# Altium schematic sheet Sheet1.SchDoc
size A3
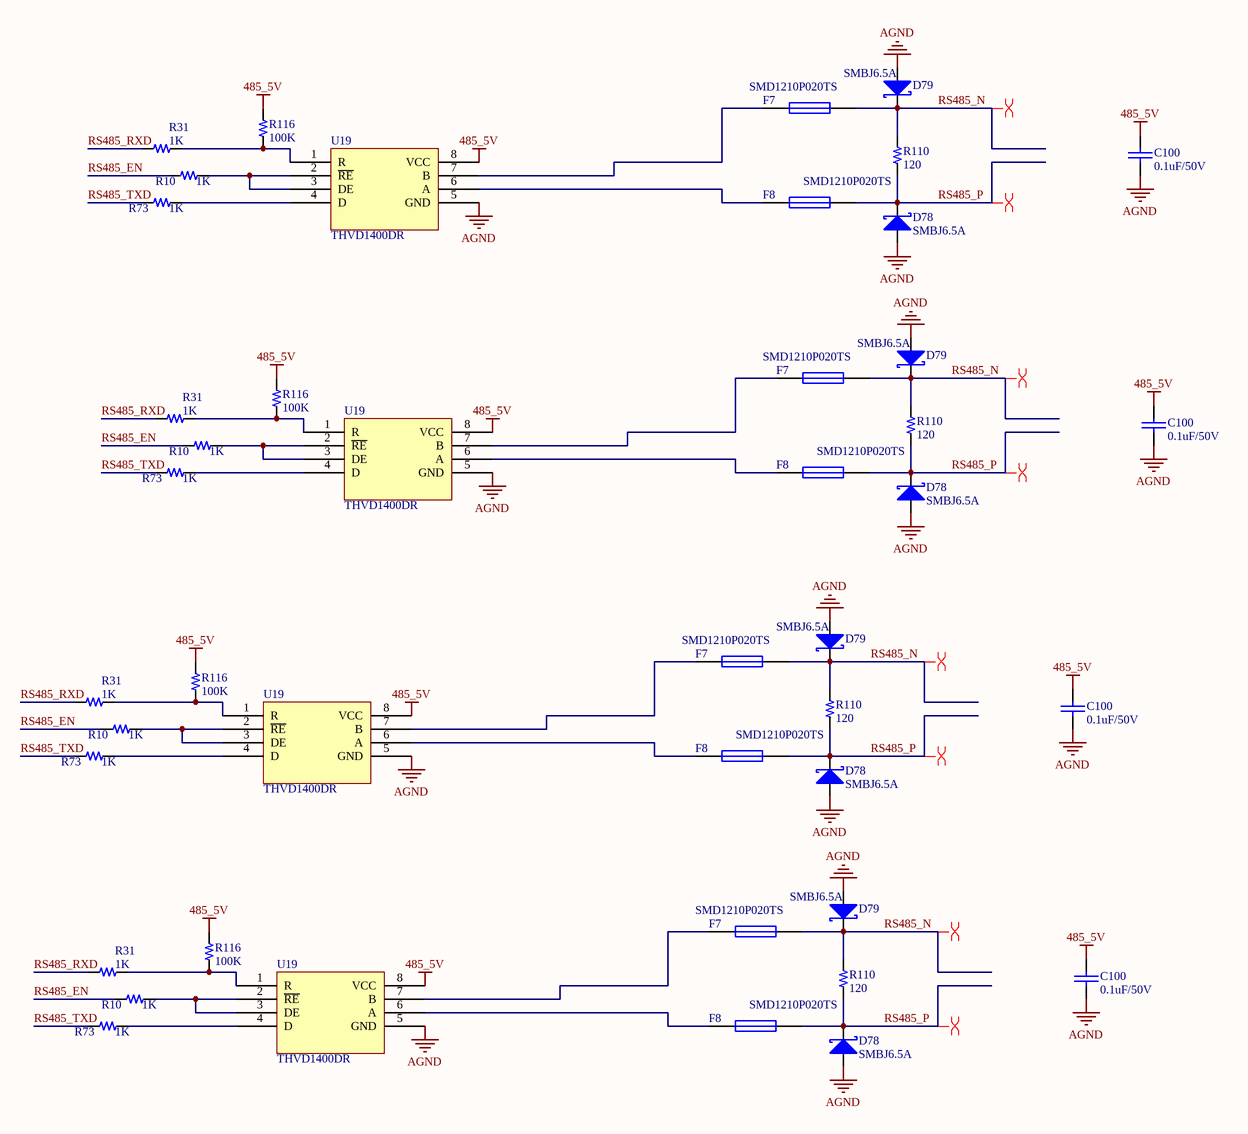
[diagram p0: Sheet1.SchDoc]

## Parts
(Parts that share a designator on the sheet are numbered #1, #2 ... from top to bottom, then left to right.)
C100#1  value 0.1uF/50V  [0603C]  (hidden comment: 0.1uF)
C100#2  value 0.1uF/50V  [0603C]  (hidden comment: 0.1uF)
C100#3  value 0.1uF/50V  [0603C]  (hidden comment: 0.1uF)
C100#4  value 0.1uF/50V  [0603C]  (hidden comment: 0.1uF)
D78#1  SMBJ6.5A  [SMB]
D78#2  SMBJ6.5A  [SMB]
D78#3  SMBJ6.5A  [SMB]
D78#4  SMBJ6.5A  [SMB]
D79#1  SMBJ6.5A  [SMB]
D79#2  SMBJ6.5A  [SMB]
D79#3  SMBJ6.5A  [SMB]
D79#4  SMBJ6.5A  [SMB]
F7#1  SMD1210P020TS  [1206R]
F7#2  SMD1210P020TS  [1206R]
F7#3  SMD1210P020TS  [1206R]
F7#4  SMD1210P020TS  [1206R]
F8#1  SMD1210P020TS  [1206R]
F8#2  SMD1210P020TS  [1206R]
F8#3  SMD1210P020TS  [1206R]
F8#4  SMD1210P020TS  [1206R]
R10#1  1K  [0603R]
R10#2  1K  [0603R]
R10#3  1K  [0603R]
R10#4  1K  [0603R]
R31#1  1K  [0603R]
R31#2  1K  [0603R]
R31#3  1K  [0603R]
R31#4  1K  [0603R]
R73#1  1K  [0603R]
R73#2  1K  [0603R]
R73#3  1K  [0603R]
R73#4  1K  [0603R]
R110#1  120  [0603R]
R110#2  120  [0603R]
R110#3  120  [0603R]
R110#4  120  [0603R]
R116#1  100K  [0603R]
R116#2  100K  [0603R]
R116#3  100K  [0603R]
R116#4  100K  [0603R]
U19#1  THVD1400DR  [so-8]
U19#2  THVD1400DR  [so-8]
U19#3  THVD1400DR  [so-8]
U19#4  THVD1400DR  [so-8]

## Nets
485_5V: C100#1.2 C100#2.2 C100#3.2 C100#4.2 R116#1.2 R116#2.2 R116#3.2 R116#4.2 U19#1.8(VCC) U19#2.8(VCC) U19#3.8(VCC) U19#4.8(VCC)
AGND: C100#1.1 C100#2.1 C100#3.1 C100#4.1 D78#1.1(A) D78#2.1(A) D78#3.1(A) D78#4.1(A) D79#1.1(A) D79#2.1(A) D79#3.1(A) D79#4.1(A) U19#1.5(GND) U19#2.5(GND) U19#3.5(GND) U19#4.5(GND)
RS485_EN: R10#1.2 R10#2.2 R10#3.2 R10#4.2
RS485_N: D79#1.2(K) D79#2.2(K) D79#3.2(K) D79#4.2(K) F7#1.2 F7#2.2 F7#3.2 F7#4.2 R110#1.1 R110#2.1 R110#3.1 R110#4.1
RS485_P: D78#1.2(K) D78#2.2(K) D78#3.2(K) D78#4.2(K) F8#1.2 F8#2.2 F8#3.2 F8#4.2 R110#1.2 R110#2.2 R110#3.2 R110#4.2
RS485_RXD: R31#1.2 R31#2.2 R31#3.2 R31#4.2
RS485_TXD: R73#1.2 R73#2.2 R73#3.2 R73#4.2
NetF7#1_1: F7#1.1 U19#1.7(B)
NetF7#2_1: F7#2.1 U19#2.7(B)
NetF7#3_1: F7#3.1 U19#3.7(B)
NetF7#4_1: F7#4.1 U19#4.7(B)
NetF8#1_1: F8#1.1 U19#1.6(A)
NetF8#2_1: F8#2.1 U19#2.6(A)
NetF8#3_1: F8#3.1 U19#3.6(A)
NetF8#4_1: F8#4.1 U19#4.6(A)
NetR10#1_1: R10#1.1 U19#1.2(~{RE}) U19#1.3(DE)
NetR10#2_1: R10#2.1 U19#2.2(~{RE}) U19#2.3(DE)
NetR10#3_1: R10#3.1 U19#3.2(~{RE}) U19#3.3(DE)
NetR10#4_1: R10#4.1 U19#4.2(~{RE}) U19#4.3(DE)
NetR31#1_1: R31#1.1 R116#1.1 U19#1.1(R)
NetR31#2_1: R31#2.1 R116#2.1 U19#2.1(R)
NetR31#3_1: R31#3.1 R116#3.1 U19#3.1(R)
NetR31#4_1: R31#4.1 R116#4.1 U19#4.1(R)
NetR73#1_1: R73#1.1 U19#1.4(D)
NetR73#2_1: R73#2.1 U19#2.4(D)
NetR73#3_1: R73#3.1 U19#3.4(D)
NetR73#4_1: R73#4.1 U19#4.4(D)

## Layout directives
differential pair: RS485_N, RS485_P

## Library data of the parts
C100#1-C100#4 = CAP
D78#1-D78#4 D79#1-D79#4 = DIODE S: Value: SMBJ6.5A
F7#1-F7#4 F8#1-F8#4 = Fuse 1: Published: 8-Jun-2000; PackageReference: PIN-W2/E2.8; Publisher: Altium Limited; Value: SMD1210P020TS
R10#1-R10#4 R31#1-R31#4 R73#1-R73#4 = R: Value: 1k/1%
R110#1-R110#4 R116#1-R116#4 = R
  R110#1-R110#4: Value: 120
  R116#1-R116#4: Value: 100K
U19#1-U19#4 = SN65HVD06D: Value: THVD1400DR